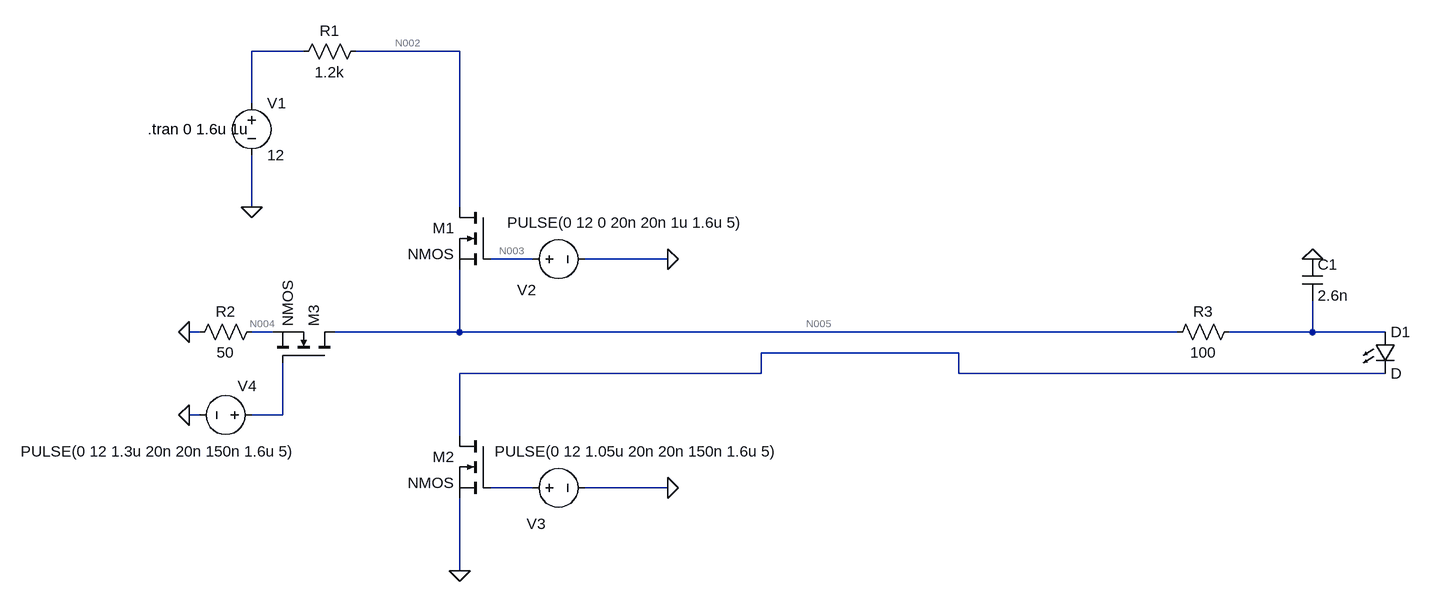
[diagram p0: schematic LEDpulser4.asc]
LEDpulser4.asc, the LTspice schematic file:
Version 4
SHEET 1 1100 680
WIRE -624 -240 -704 -240
WIRE -384 -240 -544 -240
WIRE -704 -160 -704 -240
WIRE -704 0 -704 -80
WIRE -384 0 -384 -240
WIRE -272 80 -336 80
WIRE -64 80 -192 80
WIRE -784 192 -800 192
WIRE -672 192 -704 192
WIRE -384 192 -384 96
WIRE -384 192 -576 192
WIRE 720 192 -384 192
WIRE 928 192 928 144
WIRE 928 192 800 192
WIRE 1040 192 928 192
WIRE 384 224 80 224
WIRE 80 256 80 224
WIRE 80 256 -384 256
WIRE 384 256 384 224
WIRE 1040 256 384 256
WIRE -784 320 -800 320
WIRE -656 320 -656 240
WIRE -656 320 -704 320
WIRE -384 352 -384 256
WIRE -272 432 -336 432
WIRE -64 432 -192 432
WIRE -384 560 -384 448
FLAG -64 80 0
FLAG -704 0 0
FLAG -64 432 0
FLAG -800 320 0
FLAG -800 192 0
FLAG 928 80 0
FLAG -384 560 0
SYMBOL voltage -704 -176 R0
WINDOW 123 0 0 Left 0
WINDOW 39 0 0 Left 0
SYMATTR InstName V1
SYMATTR Value 12
SYMBOL voltage -288 80 R270
WINDOW 0 -63 7 VTop 2
WINDOW 3 72 159 VBottom 2
WINDOW 123 0 0 Left 0
WINDOW 39 0 0 Left 0
SYMATTR InstName V2
SYMATTR Value PULSE(0 12 0 20n 20n 1u 1.6u 5)
SYMBOL nmos -336 0 M0
SYMATTR InstName M1
SYMBOL res -528 -256 R90
WINDOW 0 0 56 VBottom 2
WINDOW 3 32 56 VTop 2
SYMATTR InstName R1
SYMATTR Value 1.2k
SYMBOL nmos -336 352 M0
SYMATTR InstName M2
SYMBOL voltage -288 432 R270
WINDOW 0 -55 7 VRight 2
WINDOW 3 56 -42 VRight 2
WINDOW 123 0 0 Left 0
WINDOW 39 0 0 Left 0
SYMATTR InstName V3
SYMATTR Value PULSE(0 12 1.05u 20n 20n 150n 1.6u 5)
SYMBOL nmos -576 240 M270
SYMATTR InstName M3
SYMBOL res -800 208 R270
WINDOW 0 32 56 VTop 2
WINDOW 3 0 56 VBottom 2
SYMATTR InstName R2
SYMATTR Value 50
SYMBOL voltage -688 320 R90
WINDOW 0 -45 8 VRight 2
WINDOW 3 56 -54 VRight 2
WINDOW 123 0 0 Left 0
WINDOW 39 0 0 Left 0
SYMATTR InstName V4
SYMATTR Value PULSE(0 12 1.3u 20n 20n 150n 1.6u 5)
SYMBOL LED 1024 192 R0
SYMATTR InstName D1
SYMBOL cap 912 80 R0
SYMATTR InstName C1
SYMATTR Value 2.6n
SYMBOL res 816 176 R90
WINDOW 0 0 56 VBottom 2
WINDOW 3 32 56 VTop 2
SYMATTR InstName R3
SYMATTR Value 100
TEXT -864 -120 Left 2 !.tran 0 1.6u 1u

The netlist it stands for:
* LEDpulser4.asc
V1 N001 0 12
V2 N003 0 PULSE(0 12 0 20n 20n 1u 1.6u 5)
M1 N002 N003 N005 N005 NMOS
R1 N002 N001 1.2k
M2 N007 N009 0 0 NMOS
V3 N009 0 PULSE(0 12 1.05u 20n 20n 150n 1.6u 5)
M3 N005 N008 N004 N004 NMOS
R2 0 N004 50
V4 N008 0 PULSE(0 12 1.3u 20n 20n 150n 1.6u 5)
D1 N006 N007 D
C1 0 N006 2.6n
R3 N006 N005 100
.model D D
.lib standard.dio
.model NMOS NMOS
.model PMOS PMOS
.lib standard.mos
.tran 0 1.6u 1u
.backanno
.end

* Results of the author's LTspice run, read from the files saved beside the schematic
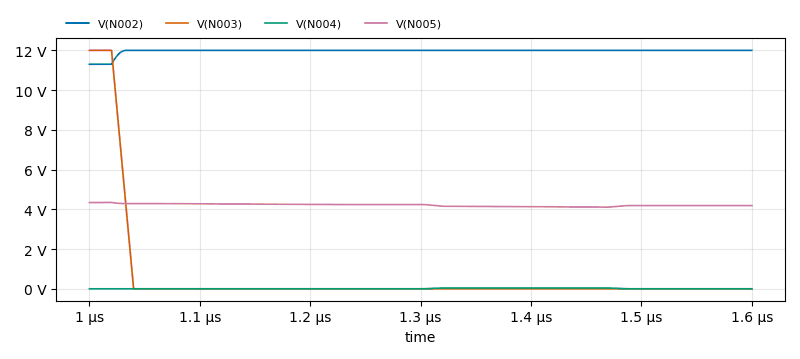
[diagram p1: Transient Analysis of LEDpulser4.asc, plotted from the saved traces]
* Transient Analysis, 1 run:
*   V(N002): min 11.3 V, max 12 V, average 11.97 V, rms 11.97 V, last 12 V
*   V(N003): min 0 V, max 12 V, average 600 mV, rms 2.532 V, last 0 V
*   V(N004): min 0 V, max 40.75 mV, average 11.29 mV, rms 21.06 mV, last 0 V
*   V(N005): min 4.11 V, max 4.345 V, average 4.214 V, rms 4.214 V, last 4.188 V